# EAGLE design sound_modem_sch (EAGLE 9.6.2)
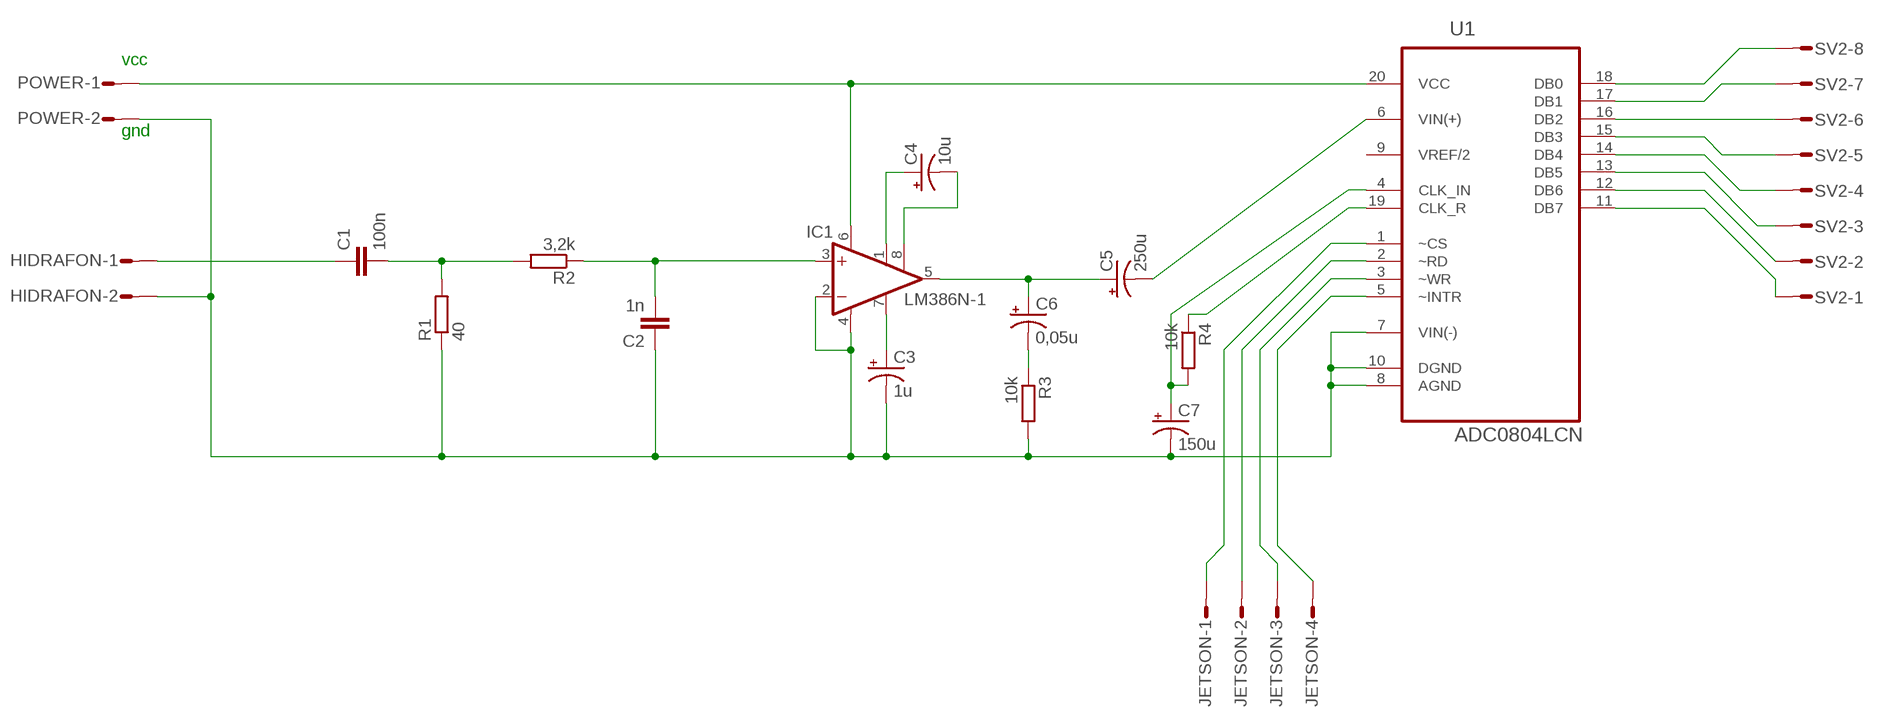
[diagram p0: schematic, sheet 1]

## Parts
C1  100n  C-EU025-025X050  [C025-025X050]
C2  1n  C-EU025-025X050  [C025-025X050]
C3  1u  CPOL-USE2-5  [E2-5]
C4  10u  CPOL-USE2-5  [E2-5]
C5  250u  CPOL-USE5-10.5  [E5-10,5]
C6  0,05u  CPOL-USE2-5  [E2-5]
C7  150u  CPOL-USE5-10.5  [E5-10,5]
HIDRAFON  L02P  [L02P]
IC1  LM386N-1  [DIL08]
JETSON  L04P  [L04P]
POWER  L02P  [L02P]
R1  40  R-EU_0204/7  [0204/7]
R2  3,2k  R-EU_0204/7  [0204/7]
R3  10k  R-EU_0204/7  [0204/7]
R4  10k  R-EU_0204/7  [0204/7]
SV2  L08P  [L08P]
U1  ADC0804LCN  [DIP254P762X508-20]

## Nets
N$1: C1.1 HIDRAFON.1
N$2: C1.2 R1.2 R2.2
N$3: C2.2 IC1.3(+IN) R2.1
N$4: C2.1 C3.- C7.- HIDRAFON.2 IC1.2(-IN) IC1.4(GND) POWER.2 R1.1 R3.2 U1.7(VIN(-)) U1.8(AGND) U1.10(DGND)
N$5: C3.+ IC1.7(BYPASS)
N$6: R4.1 U1.19(CLK_R)
N$7: IC1.6(VS) POWER.1 U1.20(VCC)
N$8: C4.+ IC1.1(GAIN)
N$9: C4.- IC1.8(GAIN)
N$10: C5.+ C6.+ IC1.5(OUT)
N$11: C6.- R3.1
N$12: C7.+ R4.2 U1.4(CLK_IN)
N$13: C5.- U1.6(VIN(+))
N$14: JETSON.1 U1.1(~CS)
N$15: JETSON.2 U1.2(~RD)
N$16: JETSON.3 U1.3(~WR)
N$17: JETSON.4 U1.5(~INTR)
N$18: SV2.8 U1.18(DB0)
N$19: SV2.7 U1.17(DB1)
N$20: SV2.6 U1.16(DB2)
N$21: SV2.5 U1.15(DB3)
N$22: SV2.4 U1.14(DB4)
N$23: SV2.3 U1.13(DB5)
N$24: SV2.2 U1.12(DB6)
N$25: SV2.1 U1.11(DB7)
Unconnected: U1.9(VREF/2)

## Notes on the sheet
- vcc
- gnd

## Library data of the parts
C1 C2 = rcl:C-EU: CAPACITOR, European symbol; SPICEPREFIX: C
C3-C7 = rcl:CPOL-US: POLARIZED CAPACITOR, American symbol; SPICEPREFIX: C
HIDRAFON POWER = con-amp-mt:L02P: AMP MT CONNECTOR; OC_FARNELL: unknown; OC_NEWARK: unknown
IC1 = linear:LM386?-*: Low Voltage Audio Power Amplifier Source: http://cache.national.com/ds/LM/LM386.pdf
JETSON = con-amp-mt:L04P: AMP MT CONNECTOR; OC_FARNELL: unknown; OC_NEWARK: unknown
R1-R4 = rcl:R-EU_: RESISTOR, European symbol; SPICEPREFIX: R
SV2 = con-amp-mt:L08P: AMP MT CONNECTOR; OC_FARNELL: unknown; OC_NEWARK: unknown
U1 = ADC0804LCN:ADC0804LCN: A/D Converter Check availability <https://pricing.snapeda.com/parts/ADC0804LCN/Texas%20Instruments/view-part?ref=eda>; AVAILABILITY: In Stock; DESCRIPTION: 1-Channel Single ADC SAR 10ksps 8-bit Parallel 20-Pin PDIP Tube; MF: Texas Instruments; MP: ADC0804LCN; PACKAGE: DIP-20 Texas Instruments; PRICE: None; PURCHASE-URL: https://pricing.snapeda.com/search/part/ADC0804LCN/?ref=eda

## Board
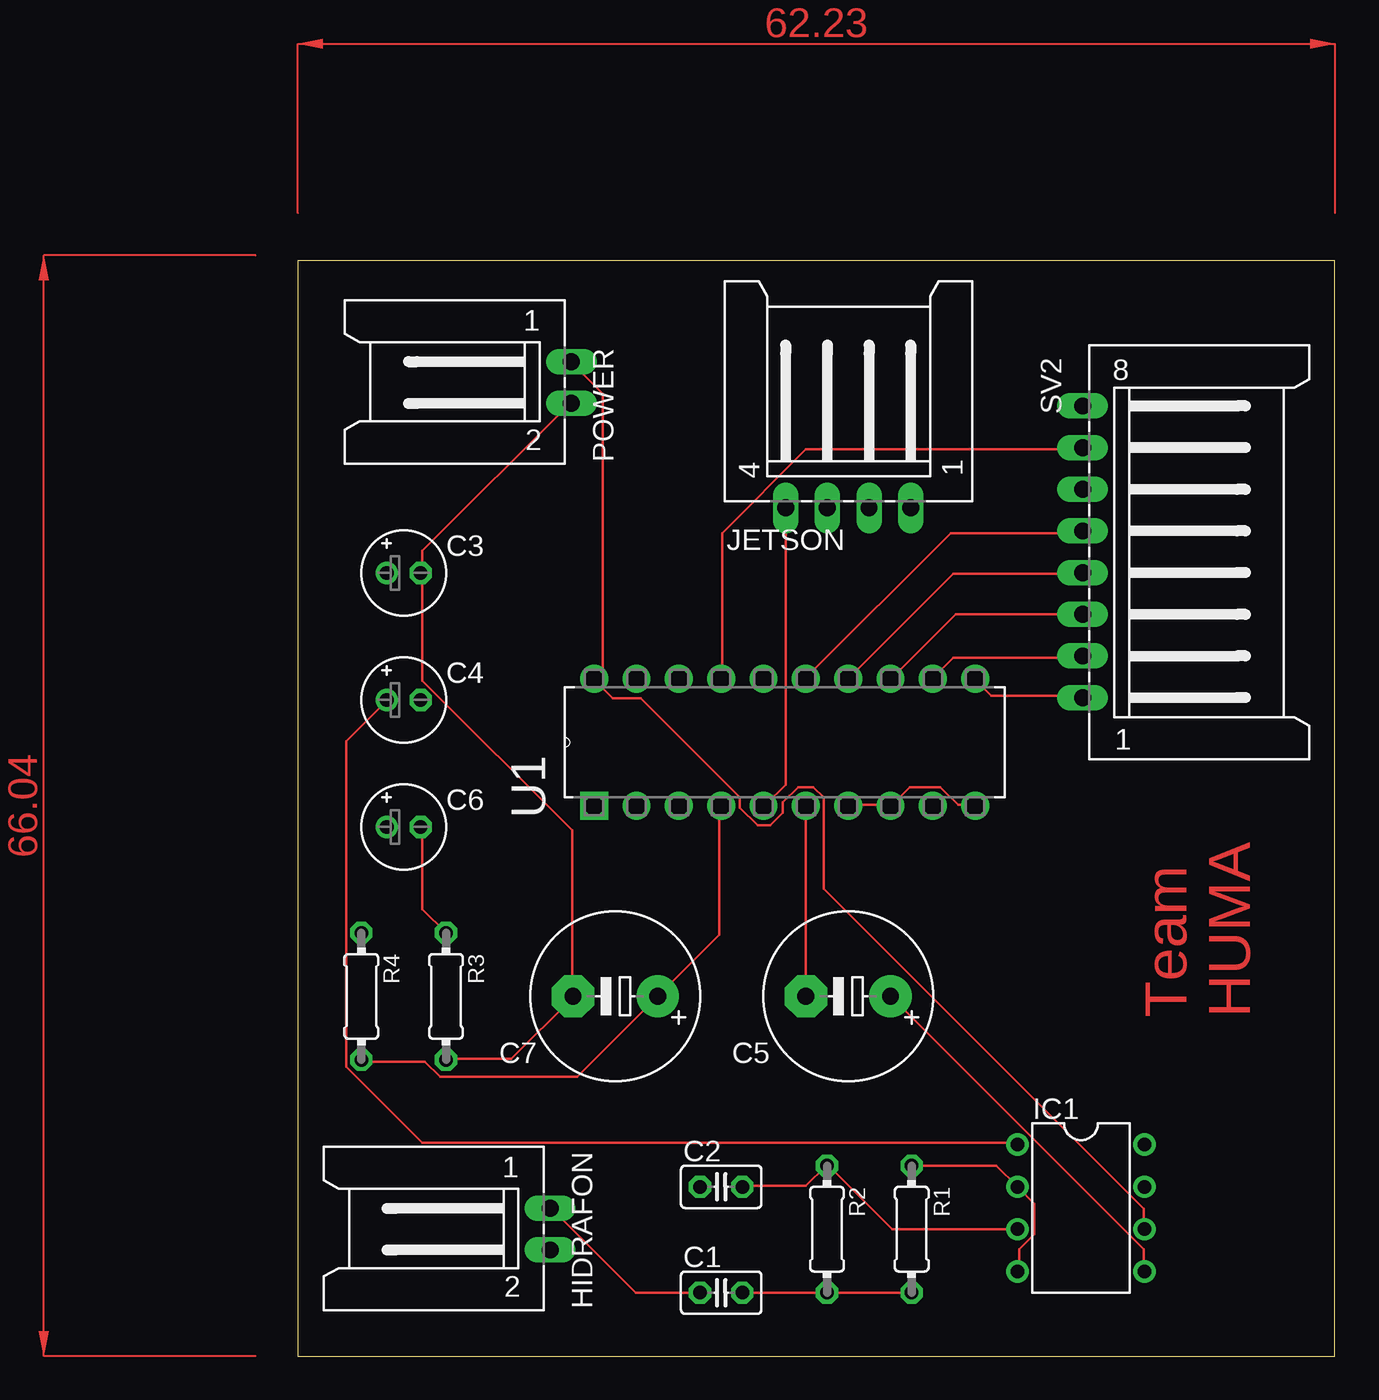
[diagram p1: board, top side]
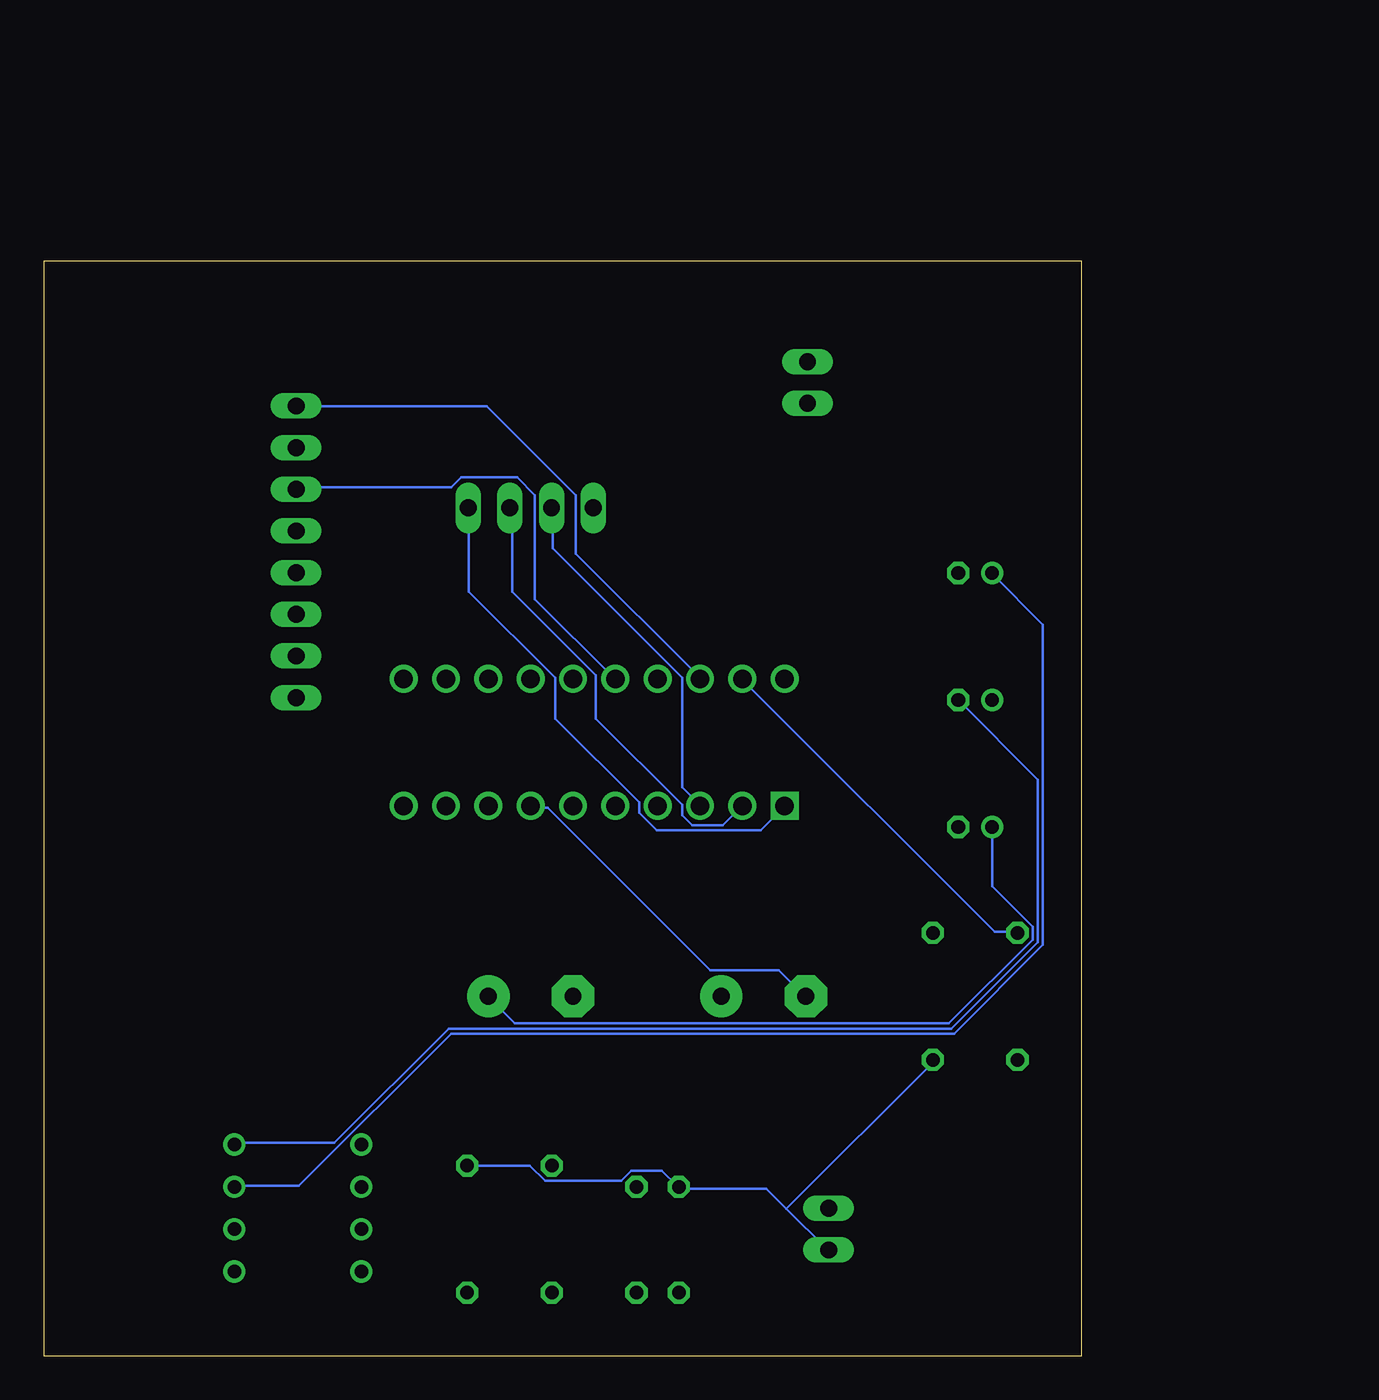
[diagram p2: board, bottom side, seen from below]

Size 62.21 x 65.71 mm. Coordinates in mm from the lower left corner, seen from the top.
Outline: 0,0 62.21,0 62.21,65.71 0,65.71 0,0
Copper layers (1*16): Top 0.035mm / dielectric 1.5mm / Bottom 0.035mm
Design rules "default": minimum track width 6mil, minimum drill 0.35mm, track to track 6mil, track to pad 6mil, pad to pad 6mil, via to via 6mil, smd to smd 6mil, copper to edge 40mil, drill to drill 6mil, minimum pad ring 10mil, minimum via ring 8mil, stop-mask expansion 4mil, vias tented up to drill 0mil, thermal gap 10mil

### Footprints (pad centres in the part's own frame; a part is rotated, then mirrored left to right if it is on the bottom)
C025-025X050 = drill 0.813 octagon: 1 -1.27,0; 2 1.27,0
E2-5 = drill 0.813 pad 1.27: + -1.016,0 | drill 0.813 pad 1.27 octagon: - 1.016,0
E5-10,5 = drill 1.016 pad 2.54: + -2.54,0 | drill 1.016 pad 2.54 octagon: - 2.54,0
L02P = drill 1.016 long: 1 1.25,-6.25; 2 -1.25,-6.25
DIL08 = drill 0.813 pad 1.27: 1 -3.81,-3.81; 2 -1.27,-3.81; 3 1.27,-3.81; 4 3.81,-3.81; 5 3.81,3.81; 6 1.27,3.81; 7 -1.27,3.81; 8 -3.81,3.81
L04P = drill 1.016 long: 1 3.75,-6.25; 2 1.25,-6.25; 3 -1.25,-6.25; 4 -3.75,-6.25
0204/7 = drill 0.813 octagon: 1 -3.81,0; 2 3.81,0
L08P = drill 1.016 long: 1 8.75,-6.25; 2 6.25,-6.25; 3 3.75,-6.25; 4 1.25,-6.25; 5 -1.25,-6.25; 6 -3.75,-6.25; 7 -6.25,-6.25; 8 -8.75,-6.25
DIP254P762X508-20 = drill 1.118 square: 1 -7.62,22.86 | drill 1.118: 2 -7.62,20.32; 3 -7.62,17.78; 4 -7.62,15.24; 5 -7.62,12.7; 6 -7.62,10.16; 7 -7.62,7.62; 8 -7.62,5.08; 9 -7.62,2.54; 10 -7.62,0; 11 0,0; 12 0,2.54; 13 0,5.08; 14 0,7.62; 15 0,10.16; 16 0,12.7; 17 0,15.24; 18 0,17.78; 19 0,20.32; 20 0,22.86

### Placement (x,y rotation side)
C1  25.4,3.81 0 top
C2  25.4,10.16 0 top
C3  6.35,46.99 0 top
C4  6.35,39.37 0 top
C5  33.02,21.59 180 top
C6  6.35,31.75 0 top
C7  19.05,21.59 180 top
HIDRAFON  8.89,7.62 90 top
IC1  46.99,8.89 270 top
JETSON  33.02,57.15 0 top
POWER  10.16,58.42 90 top
R1  36.83,7.62 270 top
R2  31.75,7.62 270 top
R3  8.89,21.59 270 top
R4  3.81,21.59 270 top
SV2  53.34,48.26 270 top
U1  40.64,40.64 90 top

### Tracks (layer width: path | path; a pad name or v marks a point on that pad's centre or on a via)
N$1
  Top 0.152: C1.1 20.27,3.81 15.24,8.84 HIDRAFON.1
N$2
  Top 0.152: C1.2 R2.2 R1.2
N$3
  Top 0.152: C2.2 26.67,10.21 30.48,10.21 31.7,11.43 R2.1 31.85,11.43 35.66,7.62 IC1.3
N$4
  Top 0.152: IC1.4 43.28,5.18 43.28,6.4 44.2,7.32 44.2,9.14 IC1.2 41.91,11.43 R1.1 | POWER.2 16.31,57.15 7.47,48.31 7.47,47.09 C3.- 7.47,46.94 7.47,40.54 16.46,31.55 16.46,21.64 C7.- 16.46,21.49 12.8,17.83 8.99,17.83 R3.2 | U1.7 33.07,33.07 35.51,33.07 U1.8 35.66,33.07 36.73,34.14 38.56,34.14 39.62,33.07 40.54,33.07 U1.10
  Bottom 0.152: 17.68,8.84 15.24,6.4 HIDRAFON.2 | 17.68,8.84 18.9,10.06 24.08,10.06 C2.1 24.23,10.21 25.15,11.12 26.98,11.12 27.58,10.52 32.16,10.52 33.07,11.43 R1.1 | U1.7 32.92,32.92 32,32.92 22.25,23.16 18.14,23.16 16.61,21.64 C7.- | 17.68,8.84 8.84,17.68 R3.2
N$5
  Bottom 0.152: IC1.7 50.75,10.21 46.94,10.21 37.8,19.36 7.62,19.36 2.29,24.69 2.29,43.89 5.33,46.94 C3.+
N$6
  Bottom 0.152: R4.1 3.81,25.45 5.18,25.45 20.27,40.54 U1.19
N$7
  Top 0.152: IC1.6 50.75,7.62 50.75,8.84 31.55,28.04 31.55,33.53 30.94,34.14 30.02,34.14 29.11,33.22 29.11,32.61 28.35,31.85 27.58,31.85 26.52,32.92 26.52,33.53 20.57,39.47 18.9,39.47 17.83,40.54 U1.20 18.29,41.15 18.29,57.76 16.46,59.59 POWER.1
N$8
  Top 0.152: IC1.1 43.13,12.8 7.47,12.8 2.9,17.37 2.9,36.88 5.33,39.32 C4.+
N$9
  Bottom 0.152: C4.- 2.59,34.59 2.59,24.84 7.77,19.66 37.95,19.66 44.81,12.8 50.75,12.8 IC1.8
N$10
  Top 0.152: C5.+ 50.75,6.4 50.75,5.18 IC1.5
  Bottom 0.152: C6.+ 5.33,28.19 2.9,25.76 2.9,24.99 7.92,19.96 33.98,19.96 35.51,21.49 C5.+
N$11
  Top 0.152: R3.1 7.47,26.82 7.47,31.7 C6.-
N$12
  Top 0.152: R4.2 3.81,17.68 7.62,17.68 8.53,16.76 16.76,16.76 C7.+ 25.3,25.3 25.3,32.92 U1.4
N$13
  Top 0.152: C5.- U1.6
N$14
  Bottom 0.152: JETSON.1 36.73,50.75 36.73,45.87 31.55,40.69 31.55,38.25 26.52,33.22 26.52,32.61 25.45,31.55 19.2,31.55 17.83,32.92 U1.1
N$15
  Bottom 0.152: U1.2 21.49,31.85 23.32,31.85 23.93,32.46 23.93,33.07 29.11,38.25 29.11,40.84 34.14,45.87 34.14,50.75 JETSON.2
N$16
  Bottom 0.152: JETSON.3 31.7,50.75 31.7,48.46 23.93,40.69 23.93,34.14 22.86,33.07 U1.3
N$17
  Top 0.152: JETSON.4 29.26,50.75 29.26,34.29 28.04,33.07 U1.5
N$18
  Bottom 0.152: SV2.8 46.94,57 35.66,57 30.33,51.66 30.33,48.16 22.86,40.69 U1.18
N$19
  Top 0.152: SV2.7 46.94,54.41 30.48,54.41 25.45,49.38 25.45,40.69 U1.17
N$20
  Bottom 0.152: SV2.6 46.94,52.12 37.8,52.12 37.19,52.73 33.83,52.73 32.77,51.66 32.77,45.41 28.04,40.69 U1.16
N$21
  Top 0.152: SV2.5 46.94,49.38 39.17,49.38 30.48,40.69 U1.15
N$22
  Top 0.152: U1.14 39.32,46.94 46.94,46.94 SV2.4
N$23
  Top 0.152: SV2.3 46.94,44.5 39.47,44.5 35.66,40.69 U1.13
N$24
  Top 0.152: SV2.2 46.94,41.91 39.32,41.91 38.1,40.69 U1.12
N$25
  Top 0.152: SV2.1 46.94,39.62 41.6,39.62 40.69,40.54 U1.11
(copper drawn outside any net)
  shapes: Top area x2

### Text on the board
Top: Team / HUMA